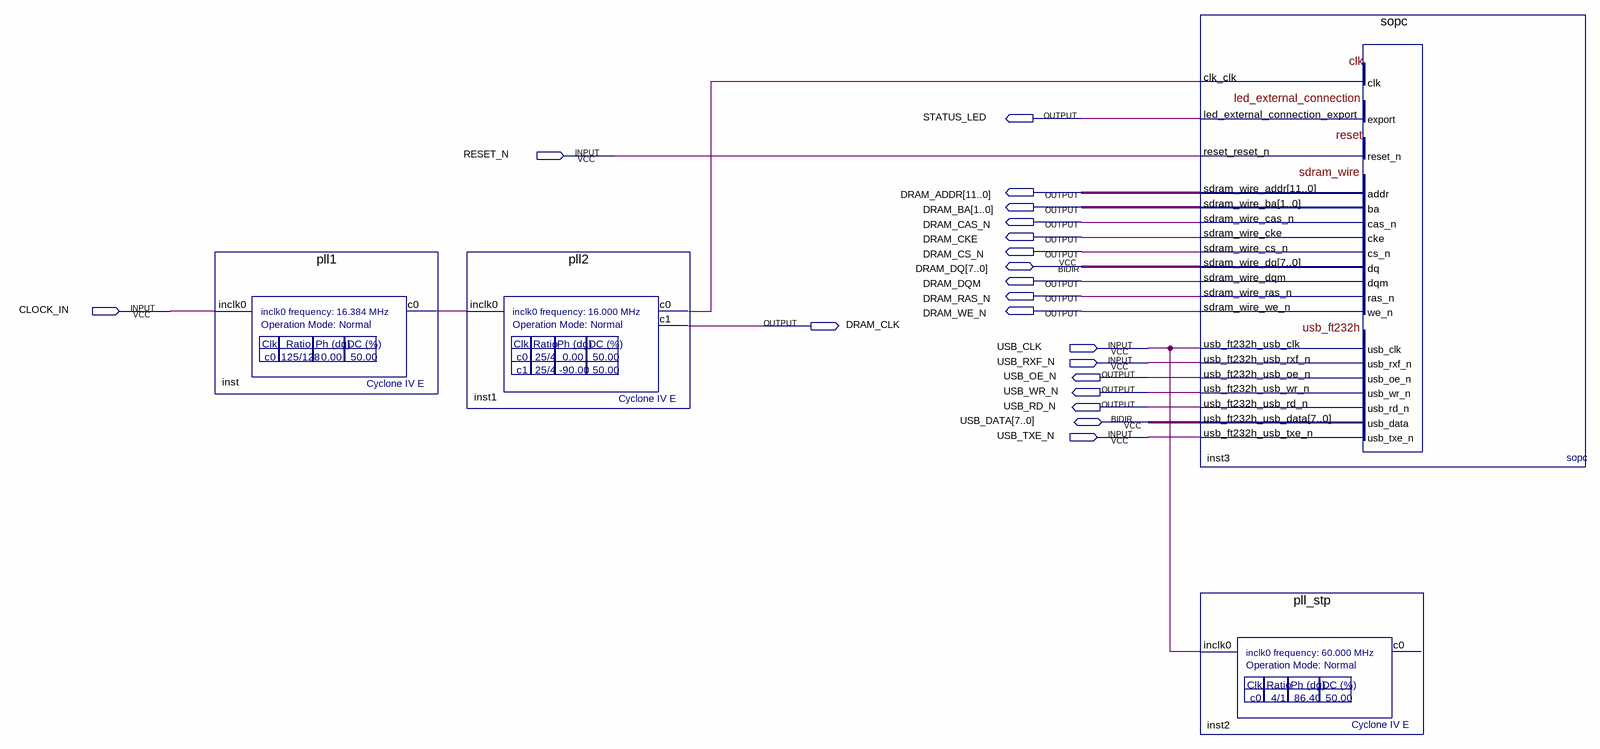
[diagram p0: schematic sheet]
// Quartus schematic test_usb_ft232h.bdf as structural Verilog: 4 symbols, 20 pins
module test_usb_ft232h (
  input  RESET_N,
  input  CLOCK_IN,
  input  USB_CLK,
  input  USB_RXF_N,
  input  USB_TXE_N,
  inout  [7:0] DRAM_DQ,
  inout  [7:0] USB_DATA,
  output STATUS_LED,
  output [11:0] DRAM_ADDR,
  output [1:0] DRAM_BA,
  output DRAM_CAS_N,
  output DRAM_CKE,
  output DRAM_CS_N,
  output DRAM_DQM,
  output DRAM_RAS_N,
  output DRAM_WE_N,
  output DRAM_CLK,
  output USB_OE_N,
  output USB_WR_N,
  output USB_RD_N
);

  wire inst1_c0, inst_c0;

  pll1 inst (.inclk0(CLOCK_IN), .c0(inst_c0));
  pll2 inst1 (.inclk0(inst_c0), .c0(inst1_c0), .c1(DRAM_CLK));
  sopc inst3 (
    .clk_clk(inst1_c0), .reset_reset_n(RESET_N), .usb_ft232h_usb_clk(USB_CLK),
    .usb_ft232h_usb_rxf_n(USB_RXF_N), .usb_ft232h_usb_txe_n(USB_TXE_N),
    .led_external_connection_export(STATUS_LED), .sdram_wire_addr(DRAM_ADDR), .sdram_wire_ba(DRAM_BA),
    .sdram_wire_cas_n(DRAM_CAS_N), .sdram_wire_cke(DRAM_CKE), .sdram_wire_cs_n(DRAM_CS_N),
    .sdram_wire_dqm(DRAM_DQM), .sdram_wire_ras_n(DRAM_RAS_N), .sdram_wire_we_n(DRAM_WE_N),
    .usb_ft232h_usb_oe_n(USB_OE_N), .usb_ft232h_usb_wr_n(USB_WR_N), .usb_ft232h_usb_rd_n(USB_RD_N),
    .sdram_wire_dq(DRAM_DQ), .usb_ft232h_usb_data(USB_DATA));
  pll_stp inst2 (.inclk0(USB_CLK));  // open: c0
endmodule
